# EAGLE design star (EAGLE 7.7.0)
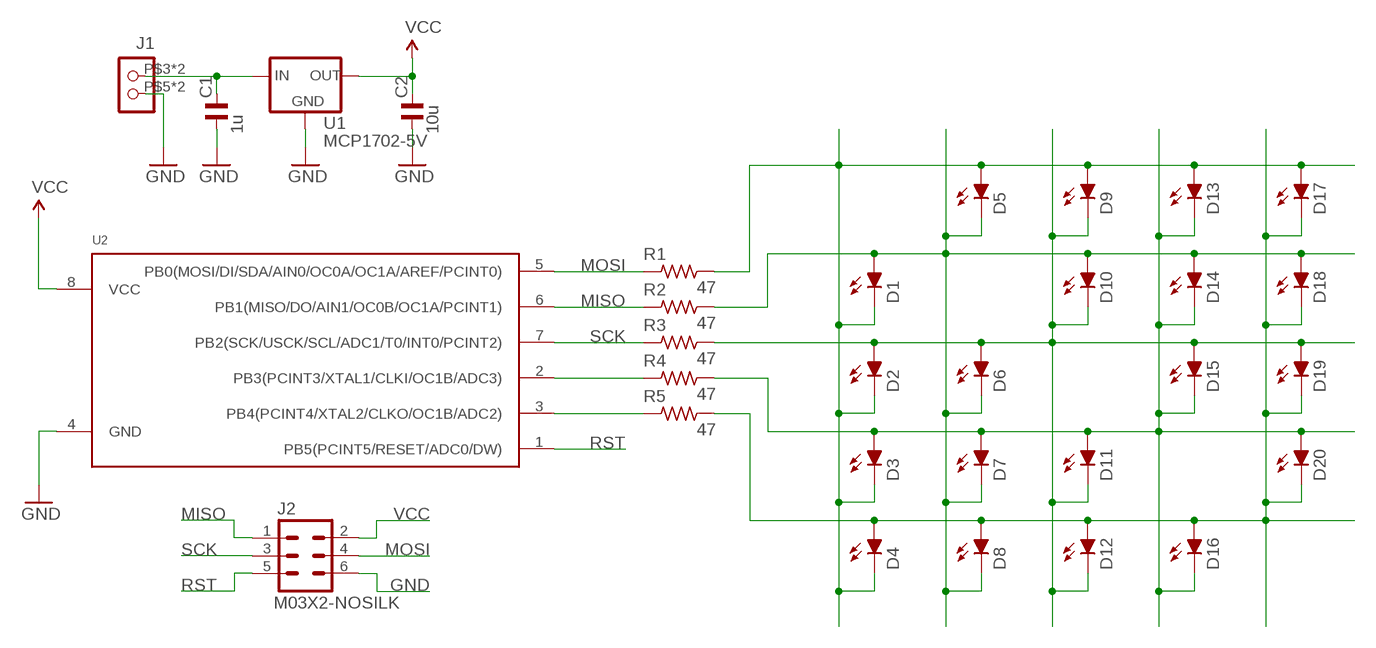
[diagram p0: schematic, sheet 1]

## Parts
C1  1u  C_0805NOSILK  [C0805NOSILK]
C2  10u  C_0805NOSILK  [C0805NOSILK]
D1  LEDCHIP-LED0805NOSILK  [CHIP-LED0805NOSILK]
D2  LEDCHIP-LED0805NOSILK  [CHIP-LED0805NOSILK]
D3  LEDCHIP-LED0805NOSILK  [CHIP-LED0805NOSILK]
D4  LEDCHIP-LED0805NOSILK  [CHIP-LED0805NOSILK]
D5  LEDCHIP-LED0805NOSILK  [CHIP-LED0805NOSILK]
D6  LEDCHIP-LED0805NOSILK  [CHIP-LED0805NOSILK]
D7  LEDCHIP-LED0805NOSILK  [CHIP-LED0805NOSILK]
D8  LEDCHIP-LED0805NOSILK  [CHIP-LED0805NOSILK]
D9  LEDCHIP-LED0805NOSILK  [CHIP-LED0805NOSILK]
D10  LEDCHIP-LED0805NOSILK  [CHIP-LED0805NOSILK]
D11  LEDCHIP-LED0805NOSILK  [CHIP-LED0805NOSILK]
D12  LEDCHIP-LED0805NOSILK  [CHIP-LED0805NOSILK]
D13  LEDCHIP-LED0805NOSILK  [CHIP-LED0805NOSILK]
D14  LEDCHIP-LED0805NOSILK  [CHIP-LED0805NOSILK]
D15  LEDCHIP-LED0805NOSILK  [CHIP-LED0805NOSILK]
D16  LEDCHIP-LED0805NOSILK  [CHIP-LED0805NOSILK]
D17  LEDCHIP-LED0805NOSILK  [CHIP-LED0805NOSILK]
D18  LEDCHIP-LED0805NOSILK  [CHIP-LED0805NOSILK]
D19  LEDCHIP-LED0805NOSILK  [CHIP-LED0805NOSILK]
D20  LEDCHIP-LED0805NOSILK  [CHIP-LED0805NOSILK]
J1  CON_TERMINAL_HOLES  [TERMINAL_2P_4H]
J2  M03X2-NOSILK  [2X03_LOCK_NOSILK]
R1  47  R_0805NOSILK  [R0805NOSILK]
R2  47  R_0805NOSILK  [R0805NOSILK]
R3  47  R_0805NOSILK  [R0805NOSILK]
R4  47  R_0805NOSILK  [R0805NOSILK]
R5  47  R_0805NOSILK  [R0805NOSILK]
U1  MCP1702-5V  V_REG_MCP170X-CB-NOSILK  [SOT23_NOSILK]
U2  ATTINY5-20SU-NOSILK  [SOP8-8S2-NOSILK]

## Nets
GND: C1.1 C2.1 J1.P$5 J1.P$6 J2.6 U1.1(GND) U2.4(GND)
MISO: J2.1 R2.1 U2.6(PB1(MISO/DO/AIN1/OC0B/OC1A/PCINT1))
MOSI: J2.4 R1.1 U2.5(PB0(MOSI/DI/SDA/AIN0/OC0A/OC1A/AREF/PCINT0))
N$1: C1.2 J1.P$3 J1.P$4 U1.3(IN)
N$4: R4.1 U2.2(PB3(PCINT3/XTAL1/CLKI/OC1B/ADC3))
N$5: R5.1 U2.3(PB4(PCINT4/XTAL2/CLKO/OC1B/ADC2))
N$7: D2.A D6.A D9.C D10.C D11.C D12.C D15.A D19.A R3.2
N$8: D1.A D5.C D6.C D7.C D8.C D10.A D14.A D18.A R2.2
N$9: D1.C D2.C D3.C D4.C D5.A D9.A D13.A D17.A R1.2
N$10: D3.A D7.A D11.A D13.C D14.C D15.C D16.C D20.A R4.2
N$11: D4.A D8.A D12.A D16.A D17.C D18.C D19.C D20.C R5.2
RST: J2.5 U2.1(PB5(PCINT5/RESET/ADC0/DW))
SCK: J2.3 R3.1 U2.7(PB2(SCK/USCK/SCL/ADC1/T0/INT0/PCINT2))
VCC: C2.2 J2.2 U1.2(OUT) U2.8(VCC)

## Library data of the parts
C1 C2 = snowflake:C_: NON-POLARIZED CAP
D1-D20 = snowflake:LED: LED Various Types
J1 = adi-misc:CON_TERMINAL_HOLES
J2 = snowflake:M03X2: This is a 3x2 pin header Note: This part is based on the Sparkfun M04X2 header.
R1-R5 = snowflake:R_: RESISTOR
U1 = snowflake:V_REG_MCP170X
U2 = snowflake:ATTINY*5: Atmel 8-bit AVR Microcontroller with 2/4/8K Bytes In-System Programmable Flash

## Board
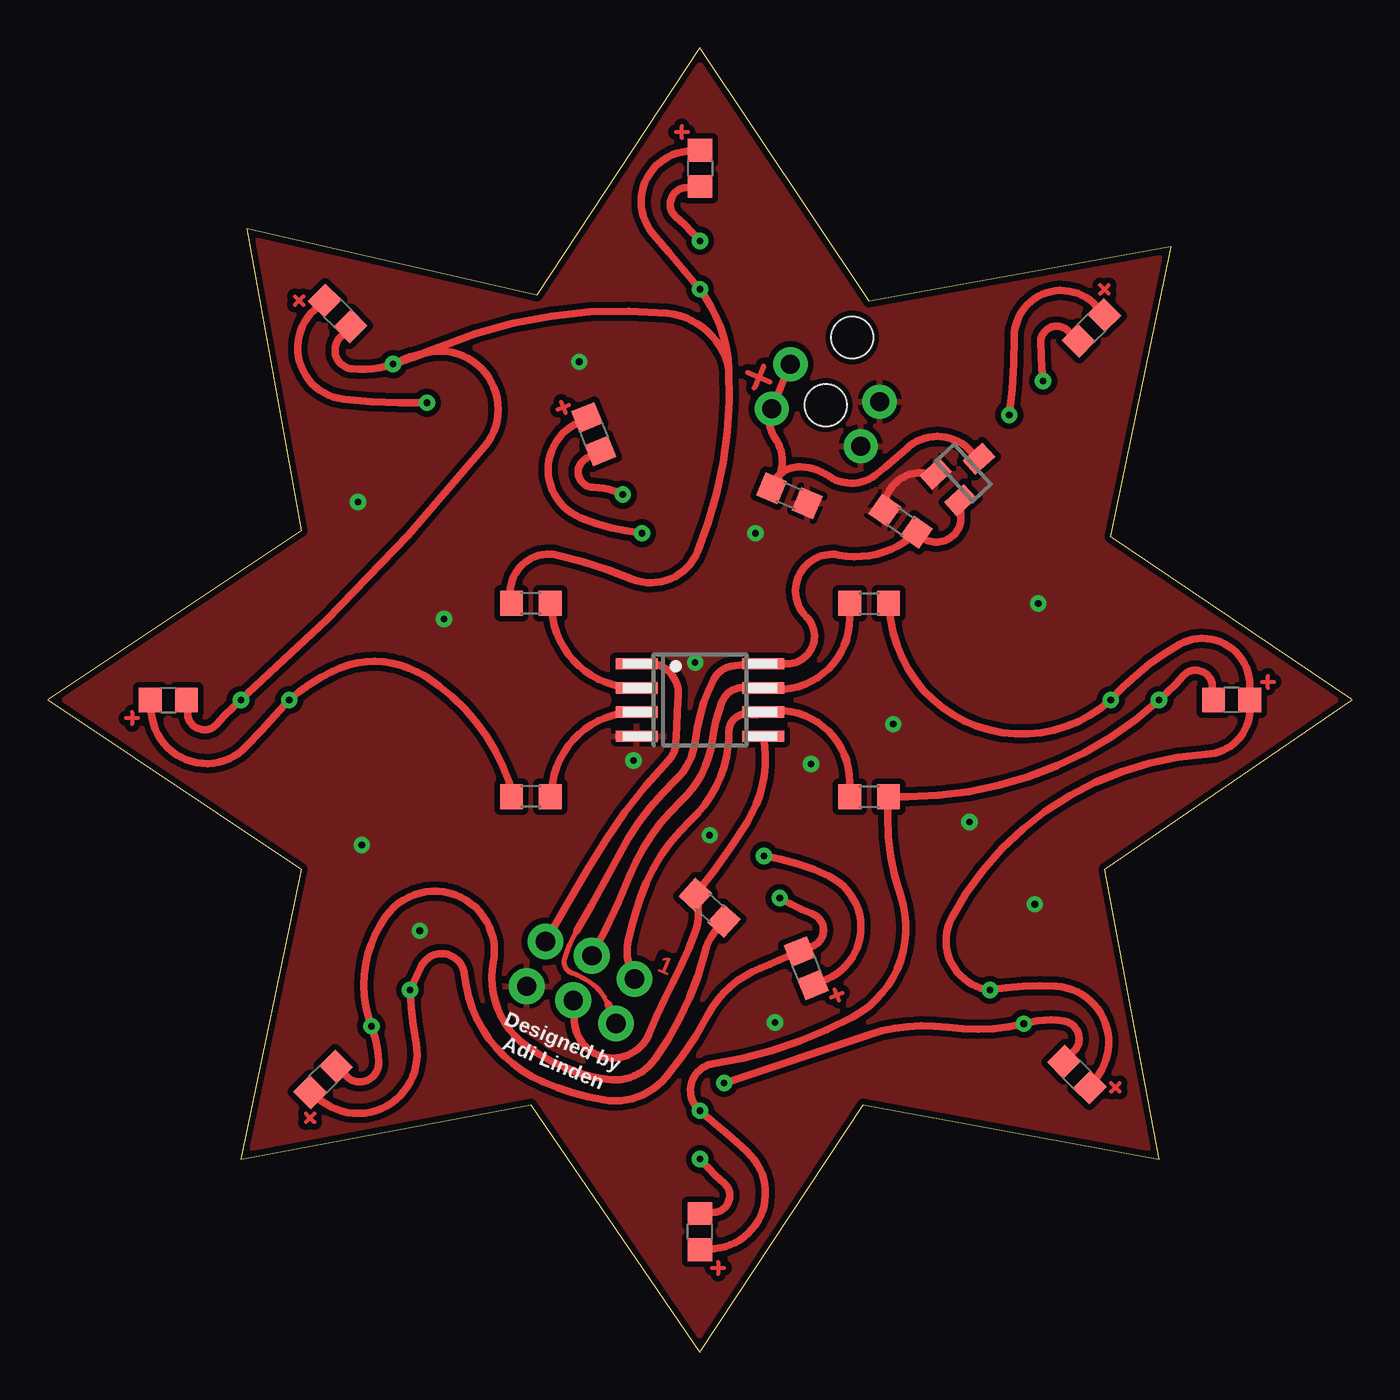
[diagram p1: board, top side]
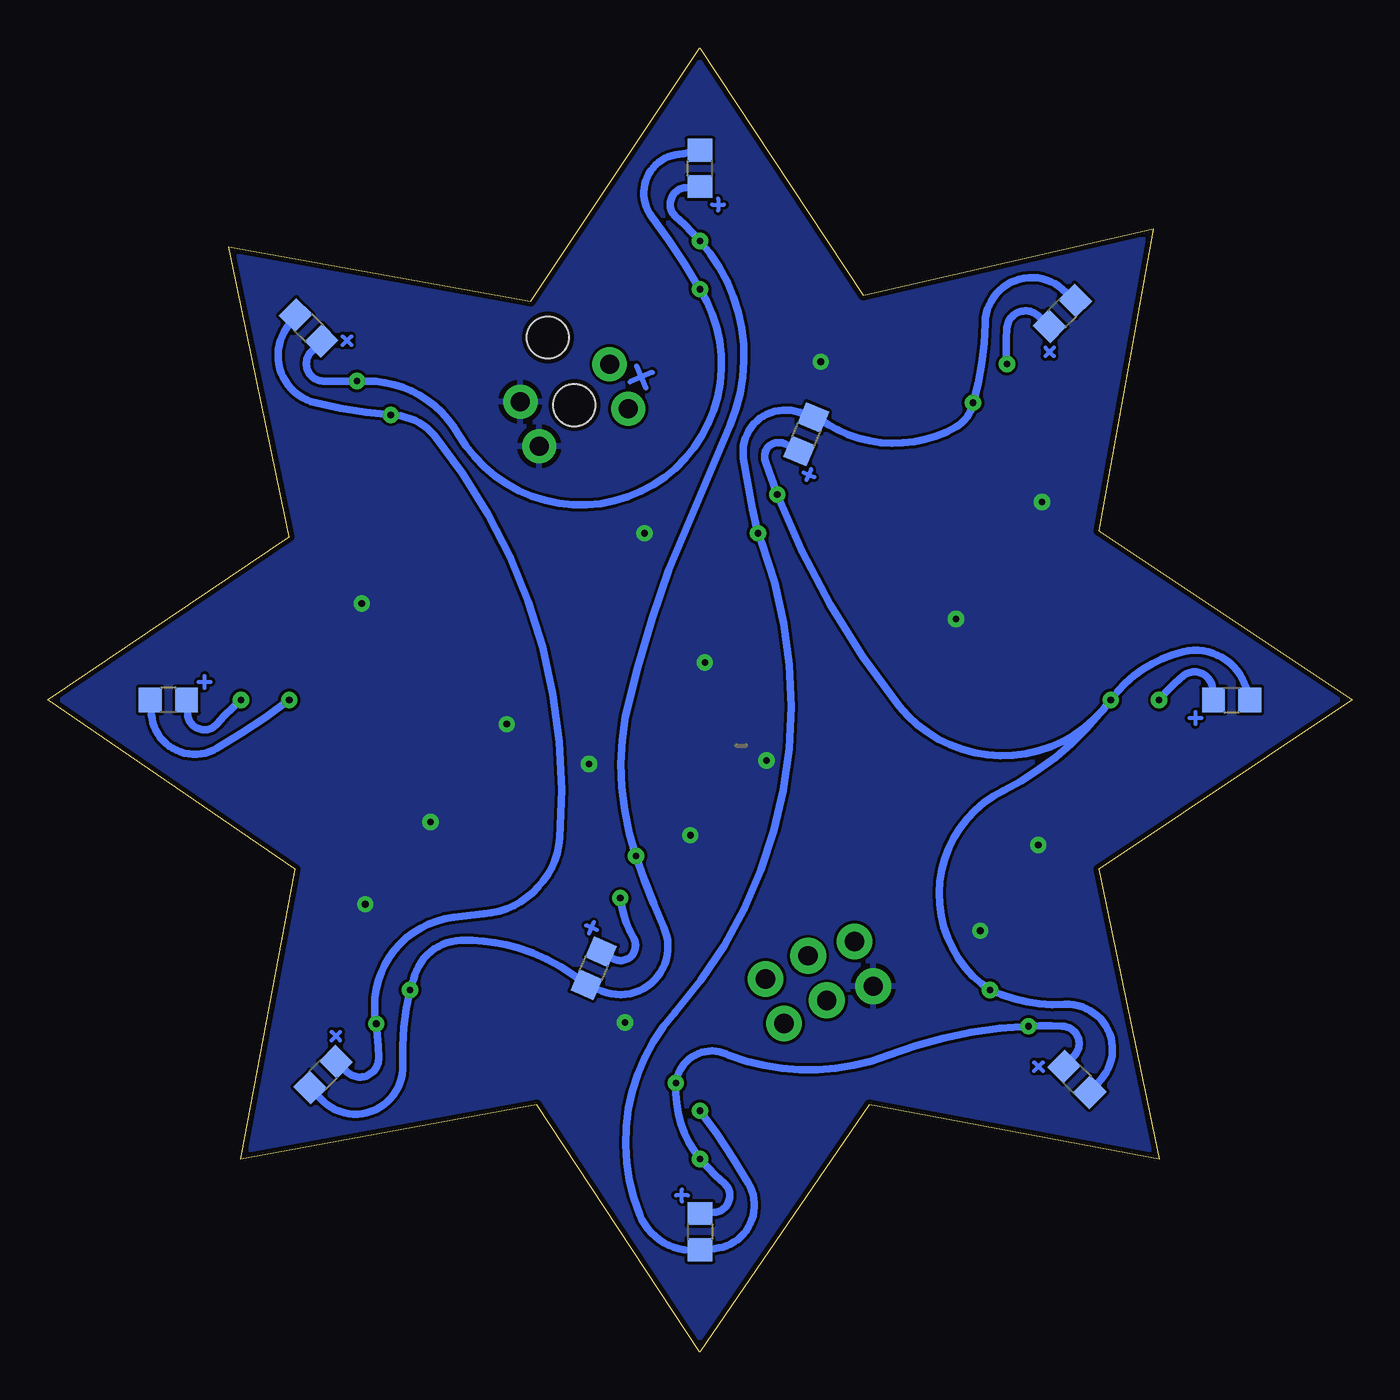
[diagram p2: board, bottom side, seen from below]

Size 68.58 x 68.58 mm. Coordinates in mm from the lower left corner, seen from the top.
Outline: 34.29,68.58 25.72,55.56 10.48,59.05 13.34,43.18 0,34.29 13.34,25.4 10.16,10.16 25.4,13.02 34.29,0 42.86,13.02 58.42,10.16 55.56,25.4 68.58,34.29 55.88,42.86 59.05,58.1 43.18,55.24 34.29,68.58
Copper layers (1*16): Top 0.035mm / dielectric 1.5mm / Bottom 0.035mm
Design rules "SeeedStudio_2layer_DRU_no_angle_20140221 *": minimum track width 6mil, minimum drill 12mil, track to track 6mil, track to pad 6mil, pad to pad 6mil, via to via 6mil, smd to smd 0mil, copper to edge 10mil, drill to drill 10mil, minimum pad ring 10mil, minimum via ring 10mil, stop-mask expansion 2mil, vias tented up to drill 25mil, thermal gap 10mil
Holes 2.2 mm at 40.89,49.78 42.29,53.34

### Footprints (pad centres in the part's own frame; a part is rotated, then mirrored left to right if it is on the bottom)
C0805NOSILK = smd 1.2 x 1.3: 1 -1.016,0; 2 1.016,0
CHIP-LED0805NOSILK = smd 1.3 x 1.2: A 0,-0.953; C 0,0.953
TERMINAL_2P_4H = drill 1 pad 1.8: P$3 -2.54,1.27; P$4 -2.54,-1.27; P$5 2.54,1.27; P$6 2.54,-1.27
2X03_LOCK_NOSILK = drill 1.016 pad 1.88: 1 -2.54,-1.143; 2 -2.54,1.397; 3 0,-1.397; 4 0,1.143; 5 2.54,-1.143; 6 2.54,1.397
R0805NOSILK = smd 1.2 x 1.3: 1 -1.016,0; 2 1.016,0
SOT23_NOSILK = smd 1 x 1.4: 1 -0.95,-1.1; 2 0.95,-1.1; 3 0,1.1
SOP8-8S2-NOSILK = smd 0.6 x 2.2: 1 -1.905,-3.33; 2 -0.635,-3.33; 3 0.635,-3.33; 4 1.905,-3.33; 5 1.905,3.33; 6 0.635,3.33; 7 -0.635,3.33; 8 -1.905,3.33

### Placement (x,y rotation side)
C1  38.99,45.02 157.2 top
C2  44.83,43.69 325.3 top
D1  34.29,6.35 0 top
D2  54.1,14.61 45 top
D3  54.86,53.85 45 bottom
D4  14.48,14.35 315 top
D5  34.29,6.35 180 bottom
D6  62.23,34.29 90 top
D7  15.24,54.61 315 bottom
D8  28.7,48.26 337 bottom
D9  54.1,14.61 135 bottom
D10  62.23,34.29 90 bottom
D11  34.29,62.23 180 top
D12  39.88,20.19 156.4 bottom
D13  54.86,53.85 135 top
D14  15.24,54.61 225 top
D15  34.29,62.23 0 bottom
D16  6.35,34.29 270 top
D17  14.48,14.35 225 bottom
D18  28.7,48.26 202 top
D19  39.88,20.19 22 top
D20  6.35,34.29 270 bottom
J1  40.89,49.78 337.2 top
J2  28.07,19.56 157.3 top
R1  34.8,23.37 317.5 top
R2  43.18,29.21 0 top
R3  43.18,39.37 0 top
R4  25.4,39.37 180 top
R5  25.4,29.21 180 top
U1  48.13,46.23 312.7 top
U2  34.29,34.29 270 top

### Tracks (layer width: path | path; a pad name or v marks a point on that pad's centre or on a via)
GND  (via drill 0.35)
  Top 0.406: U1.1 45.97,46.23 arc97 C2.1
  other vias: 27.94,52.07 20.83,38.54 52.07,39.37 44.45,33.02 19.56,22.16 40.13,30.92 16.51,26.67 30.8,31.11 34.04,36.26 51.88,23.56 16.32,44.7 34.8,27.18 48.45,27.88 38.23,17.34 37.21,43.05
  pour Bottom: 34.29,68.58 25.65,55.56 10.35,59.12 13.34,43.05 0.06,34.23 13.34,25.34 10.16,10.03 25.46,12.95 34.29,-0.13 43.05,13.08 58.42,10.16 55.56,25.4 68.77,34.35 55.88,42.93 59.05,58.23 43.18,55.31
  pour Top (isolate 0.305): 34.29,68.58 25.65,55.56 10.35,59.12 13.34,43.05 0.06,34.23 13.34,25.34 10.16,10.03 25.46,12.95 34.29,-0.13 43.05,13.08 58.42,10.16 55.56,25.4 68.77,34.35 55.88,42.93 59.05,58.23 43.18,55.31
MISO
  Top 0.406: R2.1 42.16,29.97 arc102 U2.6 arc-50 36.96,33.53 arc104 35.81,32.64 arc-11 35.69,31.37 arc-36 33.78,27.94 arc28 31.18,23.94 arc5 30.54,21.78 arc44 J2.1
MOSI
  Top 0.406: J2.4 27.69,17.4 arc155 31.62,16.76 arc-6 32.89,19.49 arc8 34.04,22.1 arc39 R1.1 arc7 36.77,27.88 arc42 U2.5
N$1
  Top 0.406: U1.3 48.39,47.5 arc87 45.15,47.5 arc-6 43.5,46.1 arc-71 41.08,46.04 arc31 39.56,46.55 arc79 C1.2 arc78 38.23,48.07 arc-58 J1.P$4 J1.P$3
N$4
  Top 0.406: R4.1 26.54,38.61 arc81 U2.2
N$5
  Top 0.406: R5.1 26.54,29.97 arc-81 U2.3
N$7  (via drill 0.35)
  Top 0.406: D11.C 33.53,61.21 arc134 33.02,59.69 arc-7 v34.29,58.42 | D9.C 55.24,14.61 arc121 53.02,19.24 arc14 v49.53,19.05 arc-110 47.5,22.8 arc-59 60.9,31.43 arc82 63.18,33.59 arc11 D10.C 63.18,35.05 arc119 59.5,37.21 arc19 v55.88,34.29 arc-124 44.32,38.48 R3.2 | D19.A 40.96,19.62 arc131 41.08,25.02 arc17 v37.66,26.1
  Bottom 0.406: D11.C 35.05,61.21 arc-134 35.56,59.69 arc7 v34.29,58.42 arc65 32.7,48.77 35.94,41.15 arc-6 38.23,33.4 arc-29 v37.66,26.1 arc-6 36.2,22.35 arc136 39.43,18.99 D12.C arc-24 43.88,21.27 arc-18 46.86,21.65 arc-75 49.34,19.62 arc-10 v49.53,19.05 arc-16 49.91,15.11 arc140 54.23,13.34 D9.C | D10.C 63.12,33.53 arc-116 59.69,31.75 arc-7 v55.88,34.29
N$8  (via drill 0.35)
  Top 0.406: D6.C 61.21,35.05 arc134 59.69,35.56 arc-7 v58.42,34.29 arc-42 45.21,29.21 R2.2 arc24 44.83,24 arc-80 42.35,17.65 arc-20 34.99,15.18 arc131 v34.29,12.7 arc-2 36.77,10.54 arc-133 35.05,5.46 D5.C | D18.A 27.69,48.77 arc128 28,43.88 arc16 v31.24,43.05 | D7.C 14.03,54.8 arc132 15.56,50.1 arc8 v19.94,49.91
  Bottom 0.406: v34.29,12.7 arc7 31.75,8.89 arc116 33.53,5.46 D5.C arc76 37.47,7.24 arc63 35.62,17.84 arc-62 31.05,42.55 v31.24,43.05 arc5 32,46.99 arc118 29.08,49.4 D8.C arc12 27.56,48.77 arc-61 20.83,48.64 arc-51 v19.94,49.91 arc-15 19.3,54.1 arc130 15.24,55.88 D7.C | D6.C 61.21,33.53 arc-134 59.69,33.02 arc7 v58.42,34.29
N$9  (via drill 0.35)
  Top 0.406: D1.C 35.05,7.37 arc134 35.56,8.89 arc-7 v34.29,10.16 | D2.C 53.98,15.88 arc122 53.47,17.4 arc28 v51.31,17.27 arc-21 47.31,17.08 arc26 43.18,16.7 v35.56,14.16 | D4.C 15.75,14.48 arc135 17.4,15.24 arc19 v17.02,17.14 arc-56 17.78,22.92 arc-155 23.43,20.51 arc64 25.15,16.13 arc28 29.4,14.35 arc64 31.94,15.43 arc20 34.54,21.02 arc-33 R1.2 | D3.C 55.12,54.99 arc138 50.8,53.34 arc-7 v50.55,49.28
  Bottom 0.406: D1.C 33.53,7.37 arc-134 33.02,8.89 arc7 v34.29,10.16 arc41 v35.56,14.16 arc111 32.77,15.62 arc-42 24.38,15.62 arc19 v17.02,17.14 arc5 15.24,17.14 arc130 14.61,15.62 D4.C | D2.C 52.83,14.73 arc-135 51.18,15.49 arc-4 v51.31,17.27 arc94 47.24,22.86 45.66,23.05 arc-81 41.66,27.05 arc-44 48.26,48.2 arc-48 v50.55,49.28 arc10 54.48,49.91 arc112 56.01,53.85 D3.C
N$10  (via drill 0.35)
  Top 0.406: D16.C 7.37,33.53 arc134 8.89,33.02 arc-7 v10.16,34.29 arc9 22.99,47.62 arc140 20.07,52.58 arc16 v18.16,51.94 | D14.C 15.37,53.34 arc127 16,51.69 arc24 v18.16,51.94 | D13.C 53.59,53.72 arc134 52.2,53.09 arc4 v52.32,51.05 | R4.2 arc-118 26.8,41.91 arc-10 30.73,40.64 arc89 34.16,42.1 arc25 35.81,51.63 | v18.16,51.94 18.54,52.07 arc4 20.57,52.83 arc-29 32.58,54.61 arc-74 35.81,51.63 | 35.81,51.63 arc31 34.54,55.5 v34.29,55.88 arc0 31.81,58.8 arc-125 33.59,63.12 D15.C
  Bottom 0.406: D16.C 7.37,34.92 arc-123 8.89,35.56 arc-12 v10.16,34.29 | D14.C 16.51,54.48 arc-127 18.16,53.85 arc-11 v18.16,51.94 | D13.C 54.74,52.58 arc-130 54.1,51.05 arc-5 v52.32,51.05 51.82,51.05 arc60 46.99,48.26 arc-182 v34.29,55.88 arc-6 36.83,59.69 arc127 35.18,62.99 D15.C
N$11  (via drill 0.35)
  Top 0.406: R5.2 arc19 24.26,29.97 arc39 19.81,35.56 arc58 14.99,35.81 arc16 v12.7,34.29 arc-1 10.48,31.88 arc-132 5.46,33.59 D20.C | D18.C 28.32,46.99 arc153 28.7,45.47 arc-29 v30.23,45.09 | D17.C 14.41,13.21 arc138 19.37,16.26 arc-9 v19.05,19.05 arc2 19.62,20.26 arc-150 21.91,19.88 arc61 26.04,14.22 arc13 29.21,13.27 arc60 32.51,14.48 arc12 34.73,17.78 arc-41 37.47,20.19 arc1 38.92,20.83 arc-3 D19.C 40.2,21.34 arc138 40.2,23.05 arc-9 v38.48,23.88
  Bottom 0.406: D20.C 5.59,34.92 arc-87 8.89,36.83 arc-41 v12.7,34.29 | D17.C 13.21,14.35 arc-135 15.11,18.29 arc28 v19.05,19.05 19.49,19.37 arc114 18.35,29.53 arc-24 13.27,33.59 v12.7,34.29 | D8.A 29.84,47.75 arc-134 30.86,46.86 arc-3 v30.23,45.09 arc-17 23.81,33.97 arc-106 v12.7,34.29 | D12.A 38.86,20.7 arc-150 37.78,21.78 arc23 v38.48,23.88
RST
  Top 0.406: J2.5 26.67,22.48 arc-3 29.34,26.92 arc-12 32.64,31.11 arc42 33.02,32 arc-1 33.15,34.54 arc82 31.88,36.2 arc23 U2.1
SCK
  Top 0.406: R3.1 42.16,38.61 arc-102 U2.7 arc-16 36.7,34.92 arc78 35.43,34.16 arc12 34.92,32.13 arc-39 33.27,28.96 arc25 30.61,25.08 arc-7 J2.3
VCC
  Top 0.254: 29.46,18.29 arc29 28.7,19.3 arc19 27.56,19.94 arc-88 27.18,20.7 arc-13 27.81,22.16
  Top 0.406: U1.2 48.01,43.94 arc-146 C2.2 arc-55 41.59,41.91 arc147 39.88,38.67 arc-135 38.86,36.2 U2.8 arc9 35.94,36.07 arc53 35.05,35.43 arc22 34.04,32.13 arc-41 33.02,30.1 arc19 30.04,26.16 arc-3 27.81,22.16 | J2.2 29.46,18.29

### Text on the board
tPlace: Designed by | Adi Linden